# EAGLE design AvrispArduino (EAGLE 6.5.0)
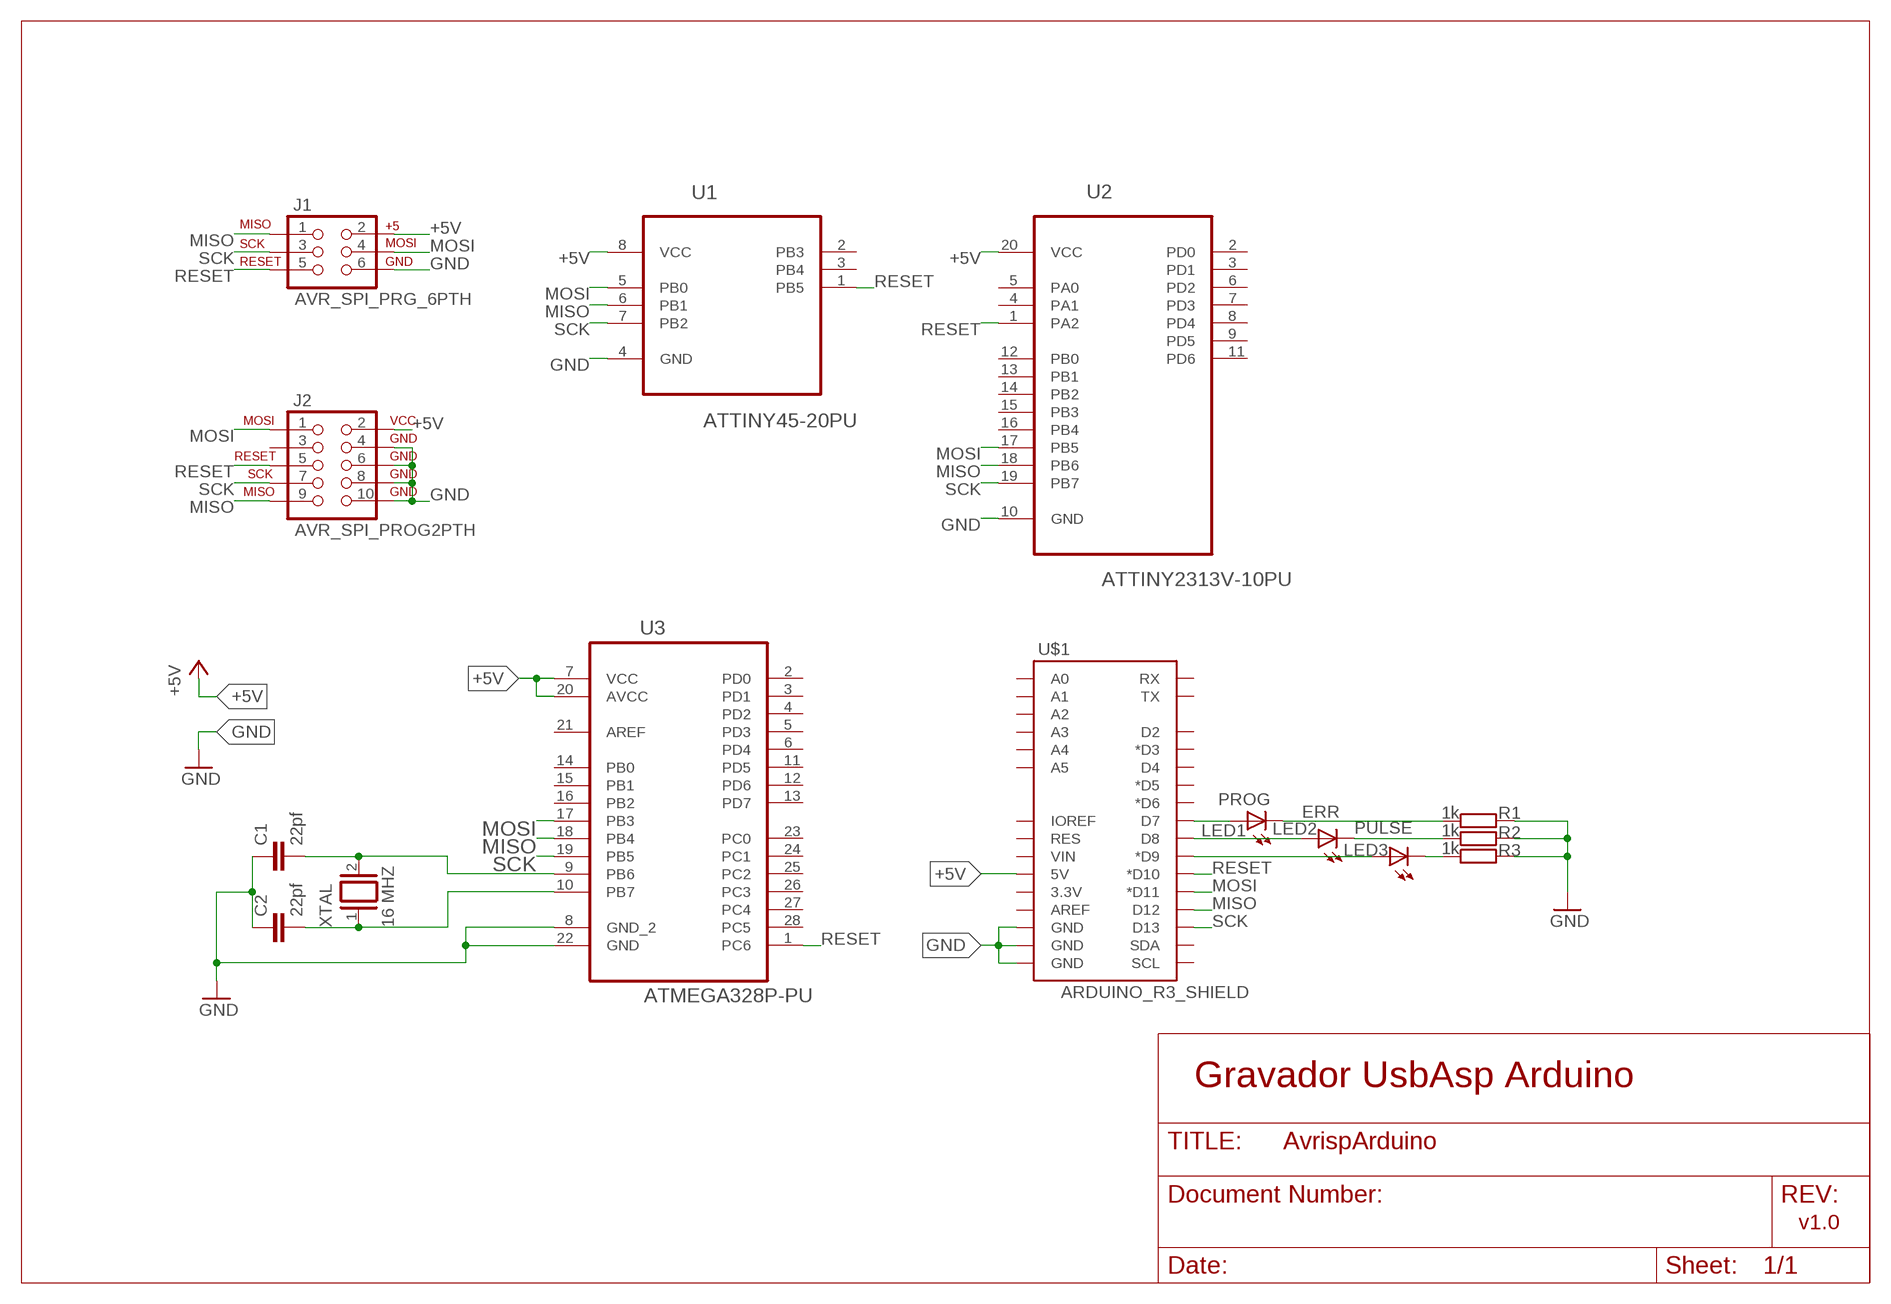
[diagram p0: schematic, sheet 1]

## Parts
C1  22pf  C-EU025-025X050  [C025-025X050]
C2  22pf  C-EU025-025X050  [C025-025X050]
J1  AVR_SPI_PRG_6PTH  [2X3]
J2  AVR_SPI_PROG2PTH  [AVR_ICSP]
LED1  PROG  LED3MM  [LED3MM]
LED2  ERR  LED3MM  [LED3MM]
LED3  PULSE  LED3MM  [LED3MM]
R1  1k  R-EU_0207/10  [0207/10]
R2  1k  R-EU_0207/10  [0207/10]
R3  1k  R-EU_0207/10  [0207/10]
U1  ATTINY45-20PU  [DIP254P762X533-8]
U2  ATTINY2313V-10PU  [DIP254P762X533-20]
U3  ATMEGA328P-PU  [DIP254P762X457-28]
U$1  ARDUINO_R3_SHIELD  [UNO_R3_SHIELD]
XTAL  16 MHZ  XTAL/S  [QS]

## Nets
+5V: J1.2 J2.2(VCC) U1.8(VCC) U2.20(VCC) U3.7(VCC) U3.20(AVCC) U$1.5V
GND: C1.1 C2.1 J1.6 J2.4(GND) J2.6(GND) J2.8(GND) J2.10(GND) R1.2 R2.2 R3.2 U1.4(GND) U2.10(GND) U3.8(GND_2) U3.22(GND) U$1.GND@0(GND) U$1.GND@1(GND) U$1.GND@2(GND)
MISO: J1.1 J2.9(MISO) U1.6(PB1) U2.18(PB6) U3.18(PB4) U$1.D12
MOSI: J1.4 J2.1(MOSI) U1.5(PB0) U2.17(PB5) U3.17(PB3) U$1.D11(*D11)
N$1: LED1.A U$1.D7
N$2: LED2.A U$1.D8
N$3: LED3.A U$1.D9(*D9)
N$4: LED1.K(C) R1.1
N$5: LED2.K(C) R2.1
N$6: LED3.K(C) R3.1
N$7: C1.2 U3.9(PB6) XTAL.2
N$8: C2.2 U3.10(PB7) XTAL.1
RESET: J1.5 J2.5(RESET) U1.1(PB5) U2.1(PA2) U3.1(PC6) U$1.D10(*D10)
SCK: J1.3 J2.7(SCK) U1.7(PB2) U2.19(PB7) U3.19(PB5) U$1.D13
Unconnected: J2.3(NC) U1.2(PB3) U1.3(PB4) U2.2(PD0) U2.3(PD1) U2.4(PA1) U2.5(PA0) U2.6(PD2) U2.7(PD3) U2.8(PD4) U2.9(PD5) U2.11(PD6) U2.12(PB0) U2.13(PB1) U2.14(PB2) U2.15(PB3) U2.16(PB4) U3.2(PD0) U3.3(PD1) U3.4(PD2) U3.5(PD3) U3.6(PD4) U3.11(PD5) U3.12(PD6) U3.13(PD7) U3.14(PB0) U3.15(PB1) U3.16(PB2) U3.21(AREF) U3.23(PC0) U3.24(PC1) U3.25(PC2) U3.26(PC3) U3.27(PC4) U3.28(PC5) U$1.3.3V U$1.A0 U$1.A1 U$1.A2 U$1.A3 U$1.A4 U$1.A5 U$1.AREF U$1.D2 U$1.D3(*D3) U$1.D4 U$1.D5(*D5) U$1.D6(*D6) U$1.IOREF U$1.RES U$1.RX U$1.SCL U$1.SDA U$1.TX U$1.VIN

## Notes on the sheet
- Gravador UsbAsp Arduino
- v1.0

## Library data of the parts
C1 C2 = rcl:C-EU: CAPACITOR, European symbol
J1 = SparkFun-Connectors:AVR_SPI_PRG_6: AVR ISP 6 Pin This is the reduced ISP connector for AVR programming. Common on Arduino. This footprint will take up less PCB space and can be used with a 10-pin to 6-pin adapter such as SKU: BOB-08508 **Special note about "TEST_POINT" package. The stop mask is on the top side, so if you want your programming test points to be on the bottom of your board, make sure to place this package on the bottom side of the board. This also ensure that the orientation to program from the bottom side will be correct.
J2 = SparkFun-Connectors:AVR_SPI_PROG2: AVR 10-pin ICSP Header This is the standard AVR In Circuit Serial Programming header. Minimal, but includes pin one indicator. Works with standard Olimex programmers. Also look for the 6-pin reduced version. Spark Fun Electronics SKU: PRT-00778
LED1-LED3 = led:LED: LED OSRAM: - CHIPLED LG R971, LG N971, LY N971, LG Q971, LY Q971, LO R971, LY R971 LH N974, LH R974 LS Q976, LO Q976, LY Q976 LO Q996 - Hyper CHIPLED LW Q18S LB Q993, LB Q99A, LB R99A - SideLED LS A670, LO A670, LY A670, LG A670, LP A670 LB A673, LV A673, LT A673, LW A673 LH A674 LY A675 LS A676, LA A676, LO A676, LY A676, LW A676 LS A679, LY A679, LG A679 - Hyper Micro SIDELED® LS Y876, LA Y876, LO Y876, LY Y876 LT Y87S - SmartLED LW L88C, LW L88S LB L89C, LB L89S, LG L890 LS L89K, LO L89K, LY L89K LS L896, LA L896, LO L896, LY L896 - TOPLED LS T670, LO T670, LY T670, LG T670, LP T670 LSG T670, LSP T670, LSY T670, LOP T670, LYG T670 LG T671, LOG T671, LSG T671 LB T673, LV T673, LT T673, LW T673 LH T674 LS T676, LA T676, LO T676, LY T676, LB T676, LH T676, LSB T676, LW T676 LB T67C, LV T67C, LT T67C, LS T67K, LO T67K, LY T67K, LW E67C LS E67B, LA E67B, LO E67B, LY E67B, LB E67C, LV E67C, LT E67C LW T67C LS T679, LY T679, LG T679 LS T770, LO T770, LY T770, LG T770, LP T770 LB T773, LV T773, LT T773, LW T773 LH T774 LS E675, LA E675, LY E675, LS T675 LS T776, LA T776, LO T776, LY T776, LB T776 LHGB T686 LT T68C, LB T68C - Hyper Mini TOPLED® LB M676 - Mini TOPLED Santana® LG M470 LS M47K, LO M47K, LY M47K Source: http://www.osram.convergy.de LUXEON: - LUMILED® LXK2-PW12-R00, LXK2-PW12-S00, LXK2-PW14-U00, LXK2-PW14-V00 LXK2-PM12-R00, LXK2-PM12-S00, LXK2-PM14-U00 LXK2-PE12-Q00, LXK2-PE12-R00, LXK2-PE12-S00, LXK2-PE14-T00, LXK2-PE14-U00 LXK2-PB12-K00, LXK2-PB12-L00, LXK2-PB12-M00, LXK2-PB14-N00, LXK2-PB14-P00, LXK2-PB14-Q00 LXK2-PR12-L00, LXK2-PR12-M00, LXK2-PR14-Q00, LXK2-PR14-R00 LXK2-PD12-Q00, LXK2-PD12-R00, LXK2-PD12-S00 LXK2-PH12-R00, LXK2-PH12-S00 LXK2-PL12-P00, LXK2-PL12-Q00, LXK2-PL12-R00 Source: www.luxeon.com KINGBRIGHT: KA-3528ASYC Source: www.kingbright.com
R1-R3 = resistor:R-EU_: RESISTOR, European symbol
U1 = Atmel_By_element14_Batch_1-00:ATTINY45-20PU: 8-bit Microcontroller with 2/4/8KBytes In-System Programmable Flash; MPN: ATTINY45-20PU; OC_FARNELL: 1288352; OC_NEWARK: 23M5072; PACKAGE: PDIP-8; SUPPLIER: Atmel
U2 = Atmel_By_element14_Batch_1-00:ATTINY2313V-10PU: Microcontroller; MPN: ATTINY2313V-10PU; OC_FARNELL: 9171614; OC_NEWARK: 01M6916; PACKAGE: DIP-20; SUPPLIER: ATMEL
U3 = Atmel_By_element14_Batch_1-00:ATMEGA328P-PU: 8-bit Microcontroller with In-System Programmable Flash; MPN: ATMEGA328P-PU; OC_FARNELL: 1715487; OC_NEWARK: 15R0268; PACKAGE: PDIP-28; SUPPLIER: Atmel
U$1 = SparkFun-Boards:ARDUINO_R3_SHIELD: Shield form compatible with the Arduino Uno R3.
XTAL = special:XTAL/S: CRYSTAL

## Board
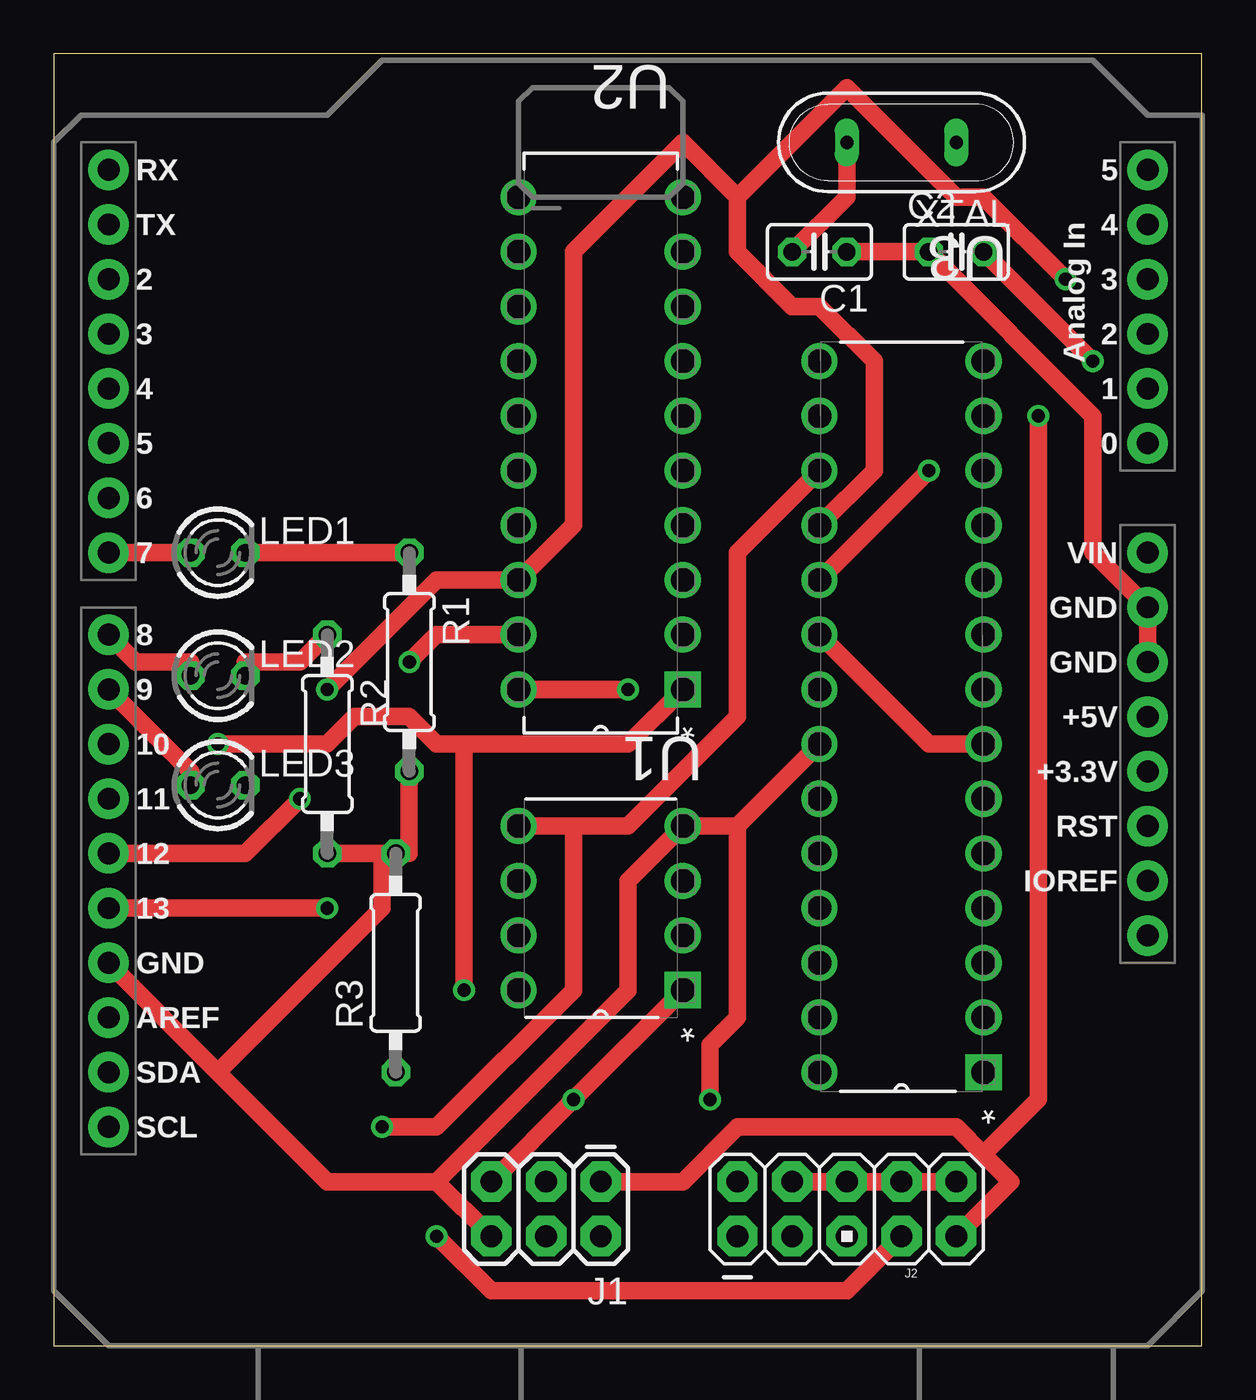
[diagram p1: board, top side]
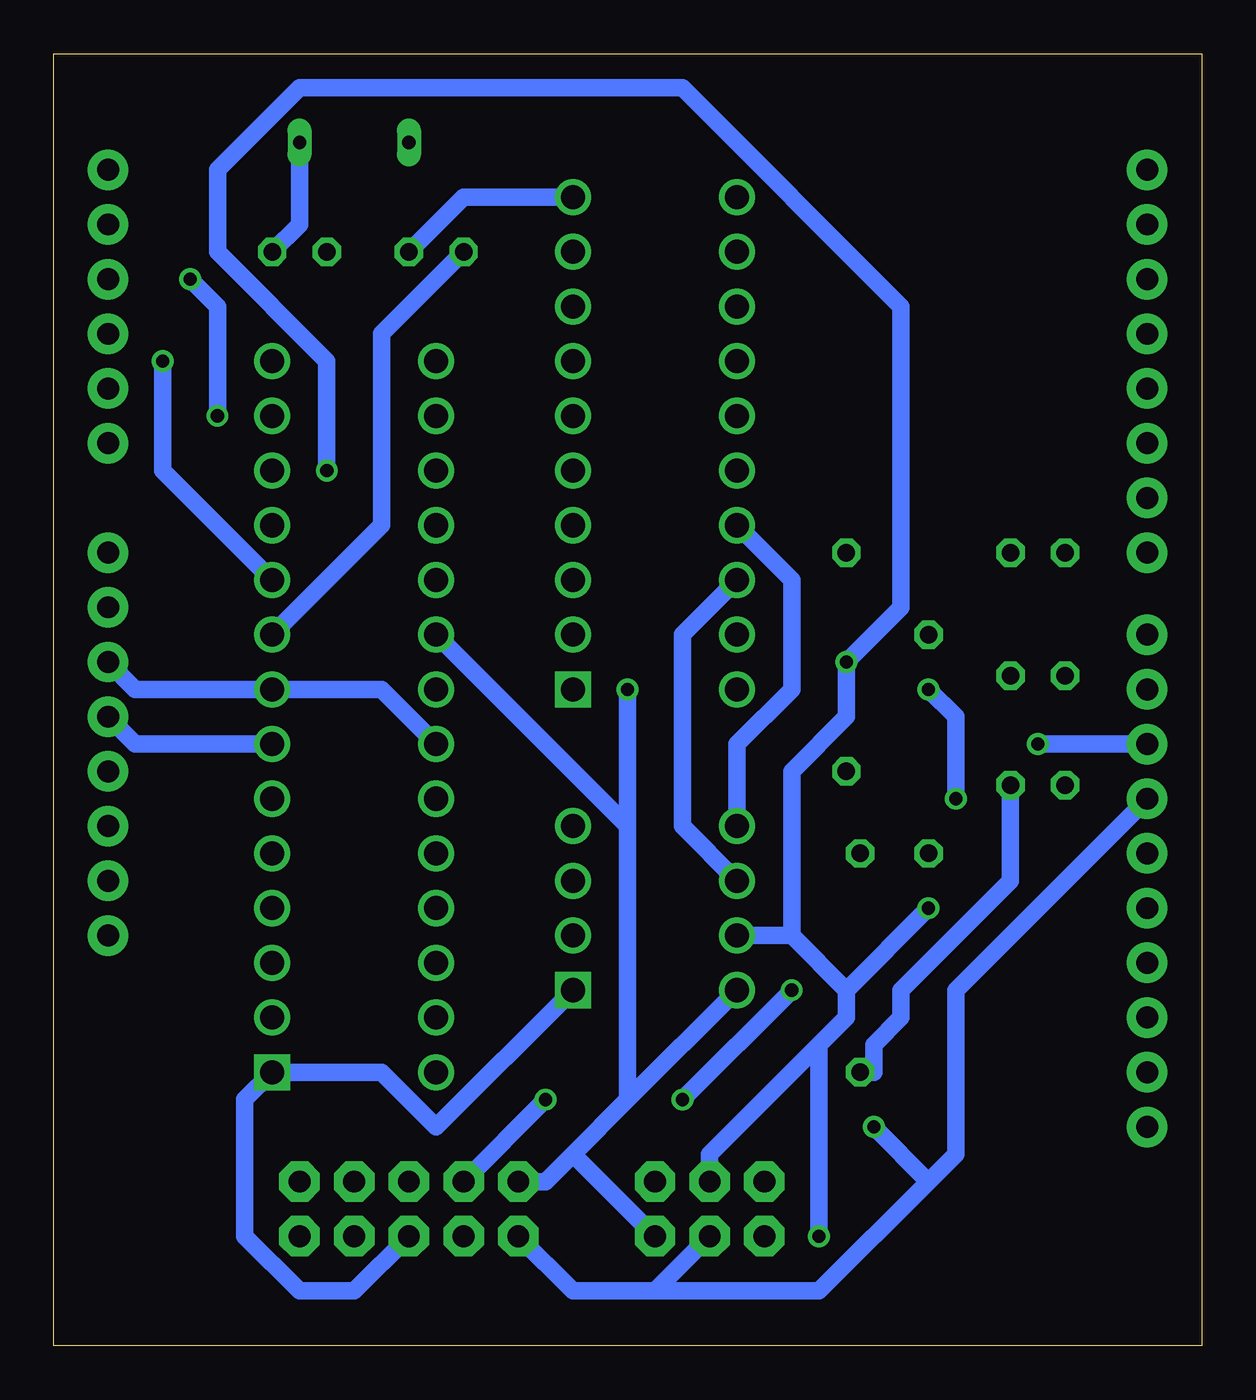
[diagram p2: board, bottom side, seen from below]

Size 53.32 x 59.99 mm. Coordinates in mm from the lower left corner, seen from the top.
Outline: 0,0 53.32,0 53.32,59.99 0,59.99 0,0
Copper layers (1*16): Top 0.035mm / dielectric 1.5mm / Bottom 0.035mm
Design rules "default *": minimum track width 32mil, minimum drill 24mil, track to track 32mil, track to pad 16mil, pad to pad 16mil, via to via 16mil, smd to smd 8mil, copper to edge 40mil, drill to drill 8mil, minimum pad ring 10mil, minimum via ring 8mil, stop-mask expansion 4mil, vias tented up to drill 0mil, thermal gap 10mil

### Footprints (pad centres in the part's own frame; a part is rotated, then mirrored left to right if it is on the bottom)
C025-025X050 = drill 0.813 octagon: 1 -1.27,0; 2 1.27,0
2X3 = drill 1.016 pad 1.88 octagon: 1 0,0; 2 0,2.54; 3 2.54,0; 4 2.54,2.54; 5 5.08,0; 6 5.08,2.54
AVR_ICSP = drill 1.016 pad 1.88 octagon: 1 -1.27,5.08; 2 1.27,5.08; 3 -1.27,2.54; 4 1.27,2.54; 5 -1.27,0; 6 1.27,0; 7 -1.27,-2.54; 8 1.27,-2.54; 9 -1.27,-5.08; 10 1.27,-5.08
LED3MM = drill 0.813 octagon: A -1.27,0; K 1.27,0
0207/10 = drill 0.813 octagon: 1 -5.08,0; 2 5.08,0
DIP254P762X533-8 = drill 1.118 square: 1 -7.62,7.62 | drill 1.118: 2 -7.62,5.08; 3 -7.62,2.54; 4 -7.62,0; 5 0,0; 6 0,2.54; 7 0,5.08; 8 0,7.62
DIP254P762X533-20 = drill 1.118 square: 1 -7.62,22.86 | drill 1.118: 2 -7.62,20.32; 3 -7.62,17.78; 4 -7.62,15.24; 5 -7.62,12.7; 6 -7.62,10.16; 7 -7.62,7.62; 8 -7.62,5.08; 9 -7.62,2.54; 10 -7.62,0; 11 0,0; 12 0,2.54; 13 0,5.08; 14 0,7.62; 15 0,10.16; 16 0,12.7; 17 0,15.24; 18 0,17.78; 19 0,20.32; 20 0,22.86
DIP254P762X457-28 = drill 1.118 square: 1 -7.62,33.02 | drill 1.118: 2 -7.62,30.48; 3 -7.62,27.94; 4 -7.62,25.4; 5 -7.62,22.86; 6 -7.62,20.32; 7 -7.62,17.78; 8 -7.62,15.24; 9 -7.62,12.7; 10 -7.62,10.16; 11 -7.62,7.62; 12 -7.62,5.08; 13 -7.62,2.54; 14 -7.62,0; 15 0,0; 16 0,2.54; 17 0,5.08; 18 0,7.62; 19 0,10.16; 20 0,12.7; 21 0,15.24; 22 0,17.78; 23 0,20.32; 24 0,22.86; 25 0,25.4; 26 0,27.94; 27 0,30.48; 28 0,33.02
UNO_R3_SHIELD = drill 1.016 pad 1.88: 3.3V 50.8,26.67; 5V 50.8,29.21; A0 50.8,41.91; A1 50.8,44.45; A2 50.8,46.99; A3 50.8,49.53; A4 50.8,52.07; A5 50.8,54.61; AREF 2.54,15.24; D2 2.54,49.53; D3 2.54,46.99; D4 2.54,44.45; D5 2.54,41.91; D6 2.54,39.37; D7 2.54,36.83; D8 2.54,33.02; D9 2.54,30.48; D10 2.54,27.94; D11 2.54,25.4; D12 2.54,22.86; D13 2.54,20.32; GND@0 50.8,31.75; GND@1 50.8,34.29; GND@2 2.54,17.78; IOREF 50.8,21.59; NC 50.8,19.05; RES 50.8,24.13; RX 2.54,54.61; SCL 2.54,10.16; SDA 2.54,12.7; TX 2.54,52.07; VIN 50.8,36.83
QS = drill 0.61 long: 1 -2.54,0; 2 2.54,0

### Placement (x,y rotation side)
C1  35.56,50.8 180 top
C2  41.91,50.8 0 top
J1  25.4,7.62 180 top
J2  36.83,6.35 90 top
LED1  7.62,36.83 0 top
LED2  7.62,31.11 0 top
LED3  7.62,26.04 0 top
R1  16.51,31.75 270 top
R2  12.7,27.94 270 top
R3  15.88,17.78 90 top
U1  21.59,24.13 180 top
U2  21.59,53.34 180 top
U3  35.56,45.72 180 top
U$1  0,0 0 top
XTAL  39.37,55.88 180 top

### Tracks (layer width: path | path; a pad name or v marks a point on that pad's centre or on a via)
+5V  (via drill 0.61)
  Top 0.813: v26.67,30.48 U2.20 | U3.7 40.64,27.94 U3.20
  Bottom 0.813: U3.7 49.53,27.94 U$1.5V | 29.21,8.89 30.48,7.62 J2.2 | 29.21,8.89 26.67,11.43 | 26.67,11.43 U1.8 | 26.67,11.43 26.67,24.13 | 26.67,24.13 v26.67,30.48 | 26.67,24.13 U3.20 | 29.21,8.89 J1.2
GND  (via drill 0.61)
  Top 0.813: 15.24,22.86 R2.2 | R1.2 16.51,22.86 R3.2 15.24,22.86 | 17.78,7.62 J1.6 | 17.78,7.62 12.7,7.62 7.62,12.7 | U$1.GND@2 7.62,12.7 | 15.24,22.86 15.24,20.32 7.62,12.7 | C1.1 C2.1 48.26,43.18 48.26,36.83 U$1.GND@1 U$1.GND@0 | J2.4 J2.6 J2.8 J2.10 | 31.75,24.13 U1.4 26.67,21.59 26.67,16.51 17.78,7.62 | U3.22 31.75,24.13 | v30.48,11.43 30.48,13.97 31.75,15.24 31.75,24.13
  Bottom 0.813: U2.10 34.29,53.34 C1.1 | U$1.GND@0 49.53,30.48 U3.8 38.1,30.48 U3.22 | v30.48,11.43 J2.4
MISO  (via drill 0.61)
  Top 0.813: J2.9 44.45,7.62 43.18,8.89 | 43.18,8.89 41.91,10.16 31.75,10.16 29.21,7.62 J1.1 | U3.18 38.1,40.64 38.1,45.72 35.56,48.26 34.29,48.26 31.75,50.8 31.75,53.34 | 31.75,53.34 29.21,55.88 24.13,50.8 24.13,38.1 U2.18 17.78,35.56 v12.7,30.48 | U$1.D12 8.89,22.86 v11.43,25.4 | 43.18,8.89 45.72,11.43 v45.72,43.18 | v46.99,49.53 43.18,53.34 41.91,53.34 36.83,58.42 31.75,53.34
  Bottom 0.813: U1.6 24.13,24.13 24.13,33.02 U2.18 | v11.43,25.4 11.43,29.21 v12.7,30.48 | v45.72,43.18 45.72,48.26 v46.99,49.53
MOSI  (via drill 0.61)
  Top 0.813: U3.17 31.75,36.83 31.75,29.21 26.67,24.13 24.13,24.13 | U1.5 24.13,24.13 | 24.13,24.13 24.13,16.51 17.78,10.16 v15.24,10.16
  Bottom 0.813: U1.5 21.59,27.94 19.05,30.48 19.05,35.56 U2.17 | 25.4,2.54 J1.4 | 25.4,2.54 29.21,2.54 J2.1 | U$1.D11 11.43,16.51 11.43,8.89 12.7,7.62 | 12.7,7.62 17.78,2.54 25.4,2.54 | 12.7,7.62 v15.24,10.16
N$1
  Top 0.813: U$1.D7 LED1.A
N$2
  Top 0.813: U$1.D8 3.81,31.75 6.35,31.75 LED2.A
N$3
  Top 0.813: U$1.D9 6.35,26.67 LED3.A
N$4
  Top 0.813: R1.1 LED1.K
N$5
  Top 0.813: R2.1 11.43,31.75 8.89,31.75 LED2.K
N$6
  Bottom 0.813: LED3.K 8.89,21.59 13.97,16.51 13.97,15.24 15.24,13.97 15.24,12.7 R3.1
N$7
  Top 0.813: XTAL.2 36.83,53.34 C1.2
  Bottom 0.813: U3.9 38.1,38.1 38.1,46.99 C1.2
N$8  (via drill 0.61)
  Top 0.813: C2.2 v48.26,45.72
  Bottom 0.813: XTAL.1 41.91,52.07 C2.2 | U3.10 48.26,40.64 v48.26,45.72
RESET  (via drill 0.61)
  Top 0.813: U2.1 26.67,27.94 19.05,27.94 | 19.05,27.94 17.78,27.94 16.51,29.21 13.97,29.21 12.7,27.94 v7.62,27.94 | U1.1 v24.13,11.43 J1.5 | v19.05,16.51 19.05,27.94
  Bottom 0.813: U$1.D10 v7.62,27.94 | U1.1 35.56,10.16 38.1,12.7 U3.1 44.45,11.43 44.45,5.08 41.91,2.54 39.37,2.54 J2.5 | v24.13,11.43 v19.05,16.51
SCK  (via drill 0.61)
  Top 0.813: U2.19 17.78,33.02 v16.51,31.75 | v40.64,40.64 U3.19 | v12.7,20.32 U$1.D13 | J2.7 36.83,2.54 20.32,2.54 v17.78,5.08
  Bottom 0.813: 19.05,19.05 U1.7 | 16.51,16.51 19.05,19.05 | 16.51,16.51 16.51,15.24 17.78,13.97 | 17.78,13.97 22.86,8.89 J1.3 | 19.05,19.05 19.05,26.67 16.51,29.21 v16.51,31.75 13.97,34.29 13.97,48.26 24.13,58.42 41.91,58.42 45.72,54.61 45.72,50.8 40.64,45.72 v40.64,40.64 | 16.51,16.51 v12.7,20.32 | 17.78,13.97 v17.78,5.08